# EAGLE design IZU2023_computerboard_ver3 (EAGLE 9.6.2)
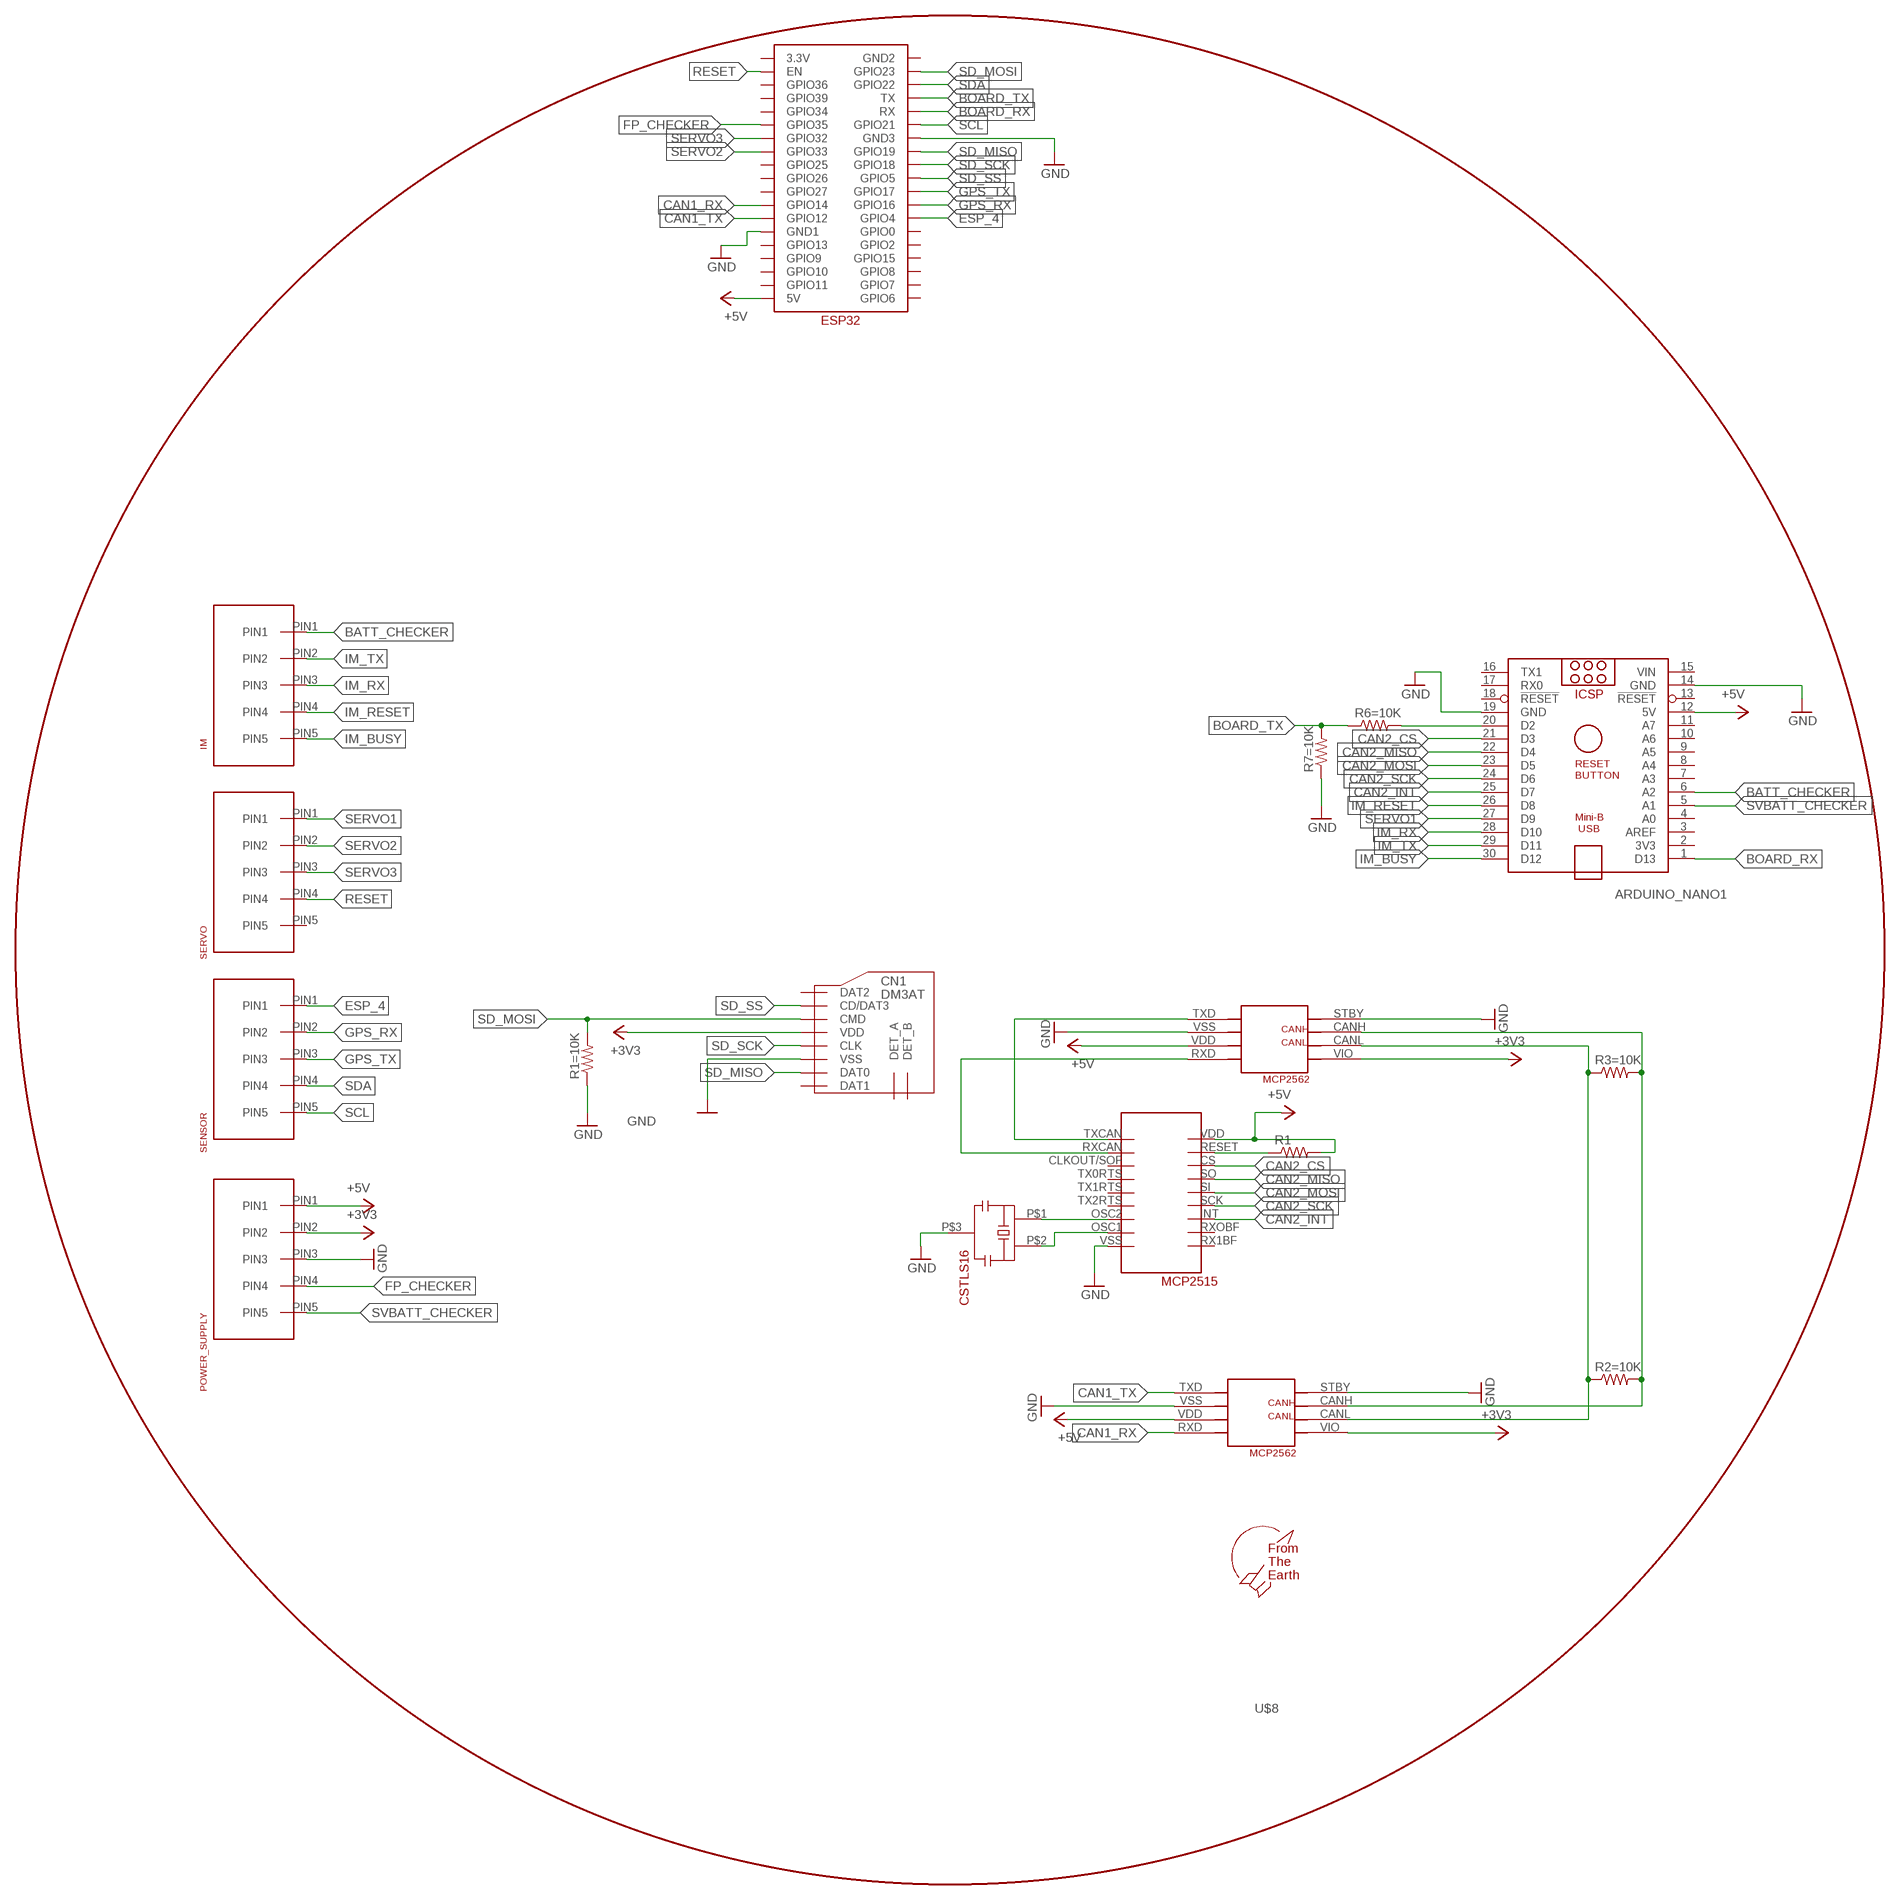
[diagram p0: schematic, sheet 1]

## Parts
ARDUINO_NANO1  ARDUINO_NANO  [ARDUINO_NANO]
CN1  DM3AT  [DM3AT]
IM  5PIN  [5PIN]
POWER_SUPPLY  5PIN  [5PIN]
R1  R-US_0204/7  [0204/7]
R1=10K  R-US_0204/7  [0204/7]
R2=10K  R-US_0204/7  [0204/7]
R3=10K  R-US_0204/7  [0204/7]
R6=10K  R-US_0204/7  [0204/7]
R7=10K  R-US_0204/7  [0204/7]
SENSOR  5PIN  [5PIN]
SERVO  5PIN  [5PIN]
U$2  MCP2515  [MCP2515]
U$3  MCP2562  [MCP2562]
U$4  MCP2562  [MCP2562]
U$5  CSTLS16  [CSTLS16]
U$7  ESP32_ESP32  [ESP32_ESP32]
U$8  F.T.E.LOGO  [LOGO]

## Nets
+3V3 [Power]: CN1.VDD POWER_SUPPLY.PIN2 U$3.VIO U$4.VIO
+5V [Power]: ARDUINO_NANO1.12(5V) POWER_SUPPLY.PIN1 R1.2 U$2.VDD U$3.VDD U$4.VDD U$7.5V
BATT_CHECKER: ARDUINO_NANO1.6(A2) IM.PIN1
BOARD_RX: ARDUINO_NANO1.1(D13) U$7.RX
BOARD_TX: R6=10K.1 R7=10K.2 U$7.TX
CAN1_RX: U$3.RXD U$7.GPIO14
CAN1_TX: U$3.TXD U$7.GPIO12
CAN2_CS: ARDUINO_NANO1.21(D3) U$2.CS
CAN2_INT: ARDUINO_NANO1.25(D7) U$2.INT
CAN2_MISO: ARDUINO_NANO1.22(D4) U$2.SO
CAN2_MOSI: ARDUINO_NANO1.23(D5) U$2.SI
CAN2_SCK: ARDUINO_NANO1.24(D6) U$2.SCK
ESP_4: SENSOR.PIN1 U$7.GPIO4
FP_CHECKER: POWER_SUPPLY.PIN4 U$7.GPIO35
GND: ARDUINO_NANO1.14(GND) ARDUINO_NANO1.19(GND) CN1.VSS POWER_SUPPLY.PIN3 R1=10K.1 R7=10K.1 U$2.VSS U$3.STBY U$3.VSS U$4.STBY U$4.VSS U$5.P$3 U$7.GND1 U$7.GND3
GPS_RX: SENSOR.PIN2 U$7.GPIO16
GPS_TX: SENSOR.PIN3 U$7.GPIO17
IM_BUSY: ARDUINO_NANO1.30(D12) IM.PIN5
IM_RESET: ARDUINO_NANO1.26(D8) IM.PIN4
IM_RX: ARDUINO_NANO1.28(D10) IM.PIN3
IM_TX: ARDUINO_NANO1.29(D11) IM.PIN2
N$1: U$2.TXCAN U$4.TXD
N$2: ARDUINO_NANO1.20(D2) R6=10K.2
N$3: R2=10K.1 R3=10K.1 U$3.CANL U$4.CANL
N$4: R2=10K.2 R3=10K.2 U$3.CANH U$4.CANH
N$5: U$2.RXCAN U$4.RXD
N$6: U$2.OSC2 U$5.P$1
N$7: U$2.OSC1 U$5.P$2
N$8: R1.1 U$2.RESET
RESET: SERVO.PIN4 U$7.EN
SCL: SENSOR.PIN5 U$7.GPIO21
SD_MISO: CN1.DAT0 U$7.GPIO19
SD_MOSI: CN1.CMD R1=10K.2 U$7.GPIO23
SD_SCK: CN1.CLK U$7.GPIO18
SD_SS: CN1.CD/DAT3 U$7.GPIO5
SDA: SENSOR.PIN4 U$7.GPIO22
SERVO1: ARDUINO_NANO1.27(D9) SERVO.PIN1
SERVO2: SERVO.PIN2 U$7.GPIO33
SERVO3: SERVO.PIN3 U$7.GPIO32
SVBATT_CHECKER: ARDUINO_NANO1.5(A1) POWER_SUPPLY.PIN5
Unconnected: ARDUINO_NANO1.2(3V3) ARDUINO_NANO1.3(AREF) ARDUINO_NANO1.4(A0) ARDUINO_NANO1.7(A3) ARDUINO_NANO1.8(A4) ARDUINO_NANO1.9(A5) ARDUINO_NANO1.10(A6) ARDUINO_NANO1.11(A7) ARDUINO_NANO1.13(!RESET) ARDUINO_NANO1.16(TX1) ARDUINO_NANO1.17(RX0) ARDUINO_NANO1.18(!RESET) CN1.DAT1 CN1.DAT2 CN1.DET_A CN1.DET_B SERVO.PIN5 U$2.CLKOUT/SOF U$2.RX1BF U$2.RXOBF(RX0BF) U$2.TX0RTS U$2.TX1RTS U$2.TX2RTS U$7.3.3V U$7.GND2 U$7.GPIO0 U$7.GPIO2 U$7.GPIO6 U$7.GPIO7 U$7.GPIO8 U$7.GPIO9 U$7.GPIO10 U$7.GPIO11 U$7.GPIO13 U$7.GPIO15 U$7.GPIO25 U$7.GPIO26 U$7.GPIO27 U$7.GPIO34 U$7.GPIO36 U$7.GPIO39

## Power pins joined to a net without a drawn wire
VIN: ARDUINO_NANO1.15(VIN)

## Library data of the parts
ARDUINO_NANO1 = ArduinoNanoV30:ARDUINO_NANO: Arduino Nano V3.0 Overview: The Arduino Nano is a small, complete, and breadboard-friendly board based on the ATmega328 (Arduino Nano 3.x) or ATmega168 (Arduino Nano 2.x). It has more or less the same functionality of the Arduino Duemilanove, but in a different package. It lacks only a DC power jack, and works with a Mini-B USB cable instead of a standard one. The Nano was designed and is being produced by Gravitech. Specifications: Microcontroller Atmel ATmega168 or ATmega328 Operating Voltage (logic level) 5 V Input Voltage (recommended) 7-12 V Input Voltage (limits) 6-20 V Digital I/O Pins 14 (of which 6 provide PWM output) Analog Input Pins 8 DC Current per I/O Pin 40 mA Flash Memory 16 KB (ATmega168) or 32 KB (ATmega328) of which 2 KB used by bootloader SRAM 1 KB (ATmega168) or 2 KB (ATmega328) EEPROM 512 bytes (ATmega168) or 1 KB (ATmega328) Clock Speed 16 MHz Dimensions 0.73" x 1.70" Length 45 mm Width 18 mm Weigth 5 g Power: The Arduino Nano can be powered via the Mini-B USB connection, 6-20V unregulated external power supply (pin 30), or 5V regulated external power supply (pin 27). The power source is automatically selected to the highest voltage source. Memory: The ATmega168 has 16 KB of flash memory for storing code (of which 2 KB is used for the bootloader); the ATmega328 has 32 KB, (also with 2 KB used for the bootloader). The ATmega168 has 1 KB of SRAM and 512 bytes of EEPROM (which can be read and written with the EEPROM library); the ATmega328 has 2 KB of SRAM and 1 KB of EEPROM. Input and Output: Each of the 14 digital pins on the Nano can be used as an input or output, using pinMode(), digitalWrite(), and digitalRead() functions. They operate at 5 volts. Each pin can provide or receive a maximum of 40 mA and has an internal pull-up resistor (disconnected by default) of 20-50 kOhms. In addition, some pins have specialized functions. Visit Arduino - ArduinoBoardNano <https://www.arduino.cc/en/Main/ArduinoBoardNano>
CN1 = microSD:DM3AT
IM POWER_SUPPLY SENSOR SERVO = connectors:5PIN
R1 R1=10K R2=10K R3=10K R6=10K R7=10K = rcl:R-US_: RESISTOR, American symbol; SPICEPREFIX: R
U$2 = MCP2515:MCP2515
U$3 U$4 = MCP2562:MCP2562
U$5 = CSTLS16:CSTLS16
U$7 = ESPdev:ESP32_ESP32
U$8 = logo:F.T.E.LOGO

## Net classes
1 Power: width 1.016 mm

## Board
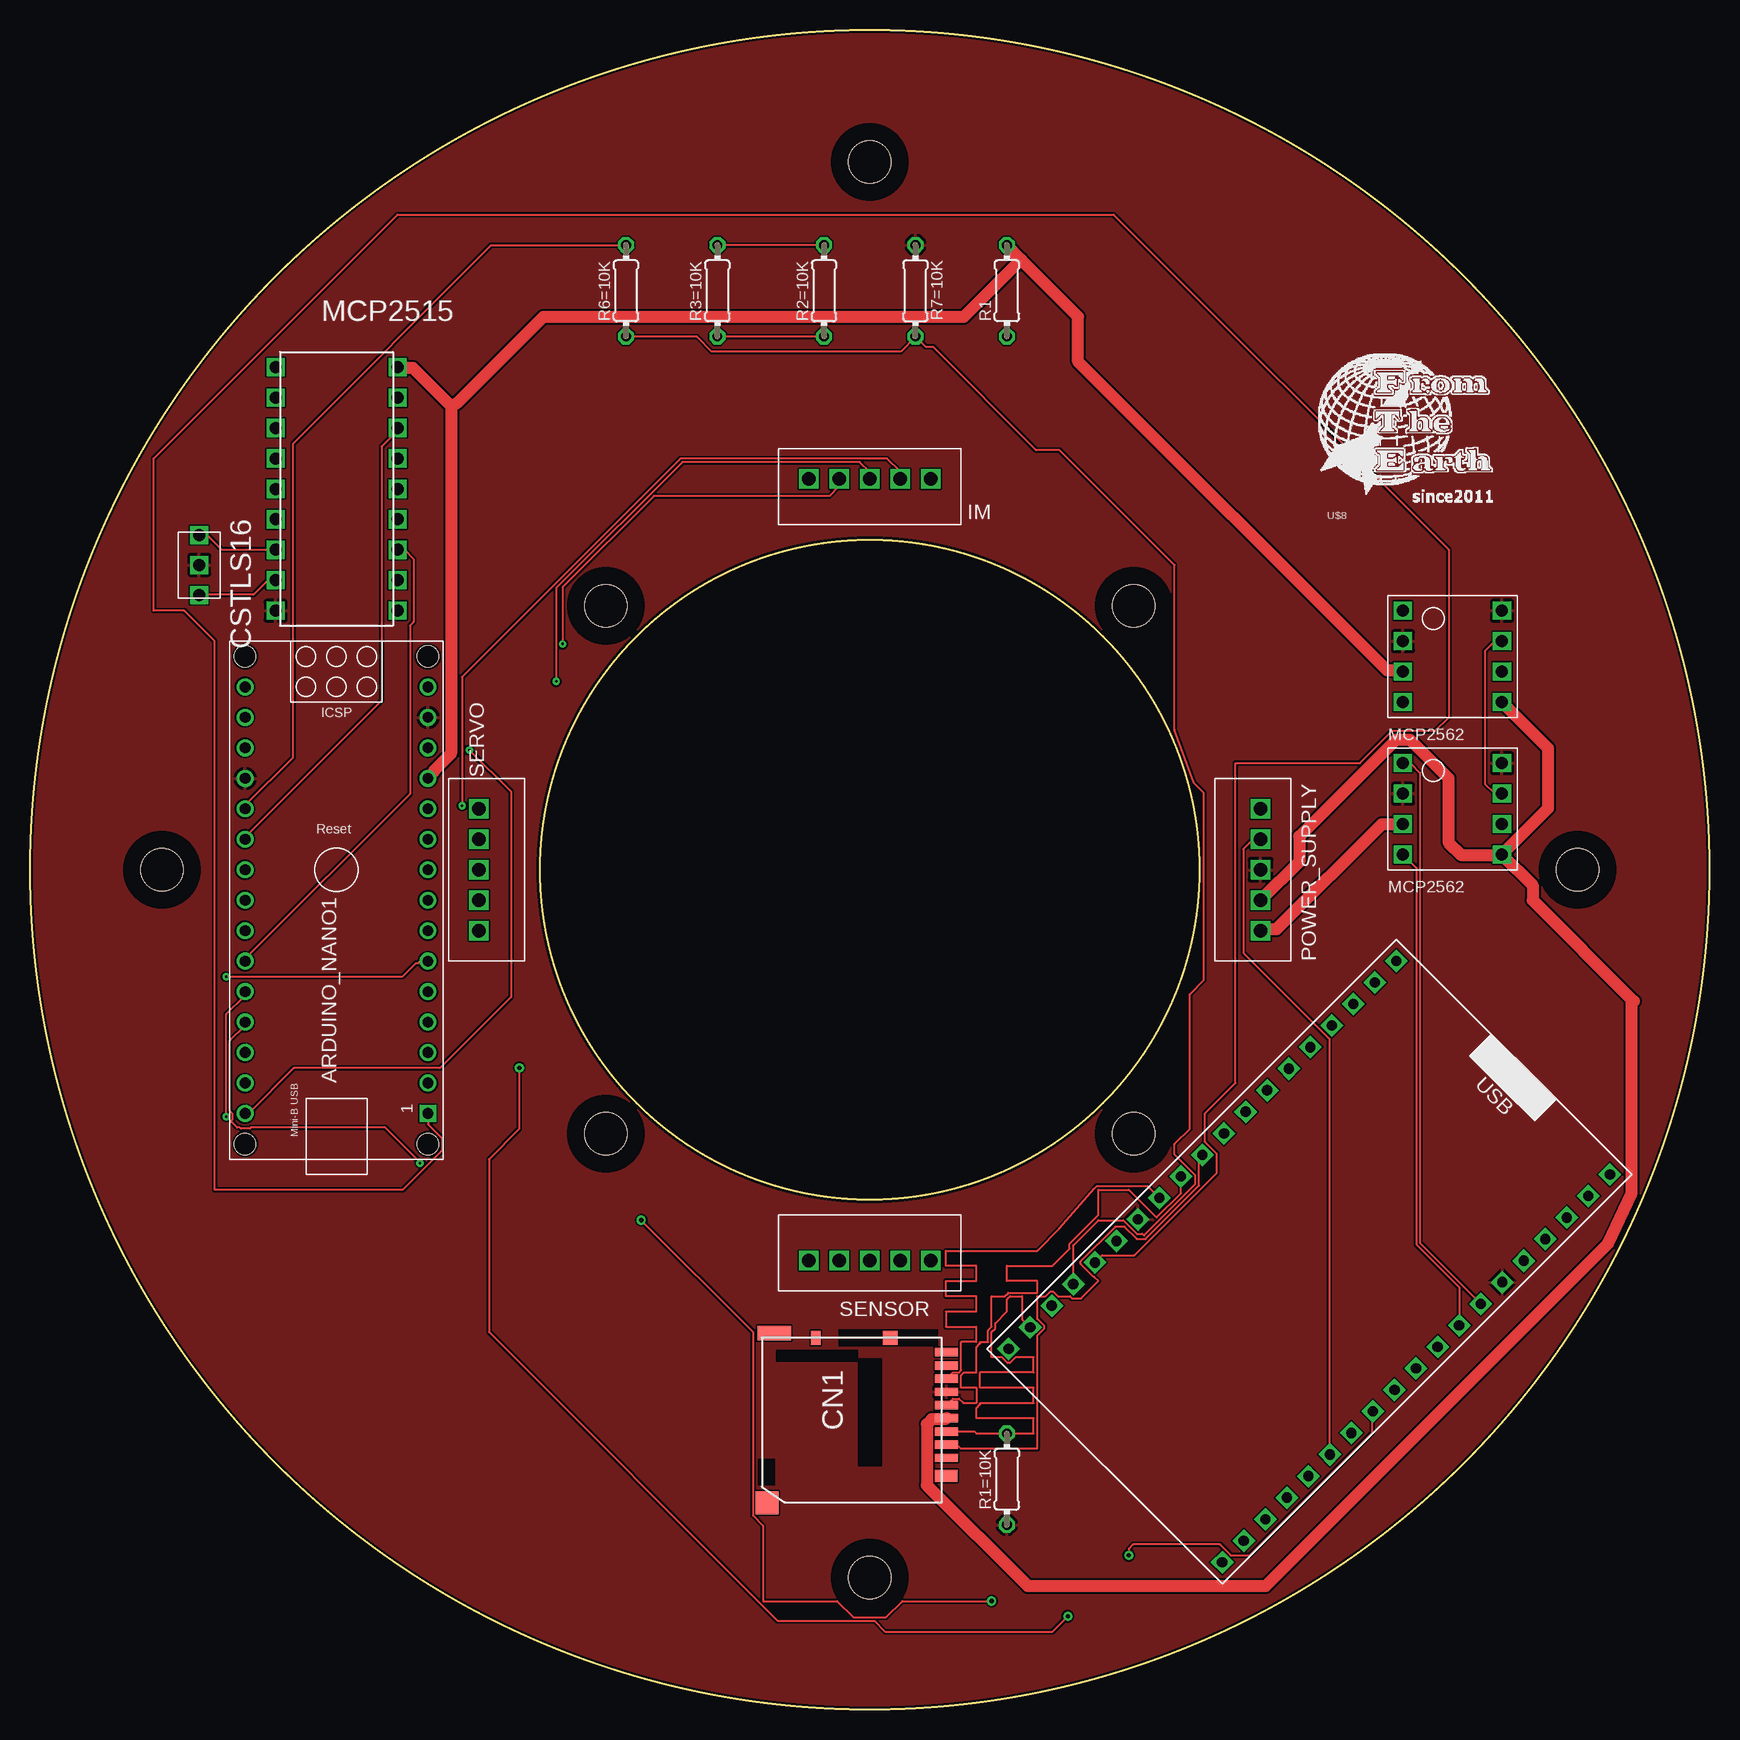
[diagram p1: board, top side]
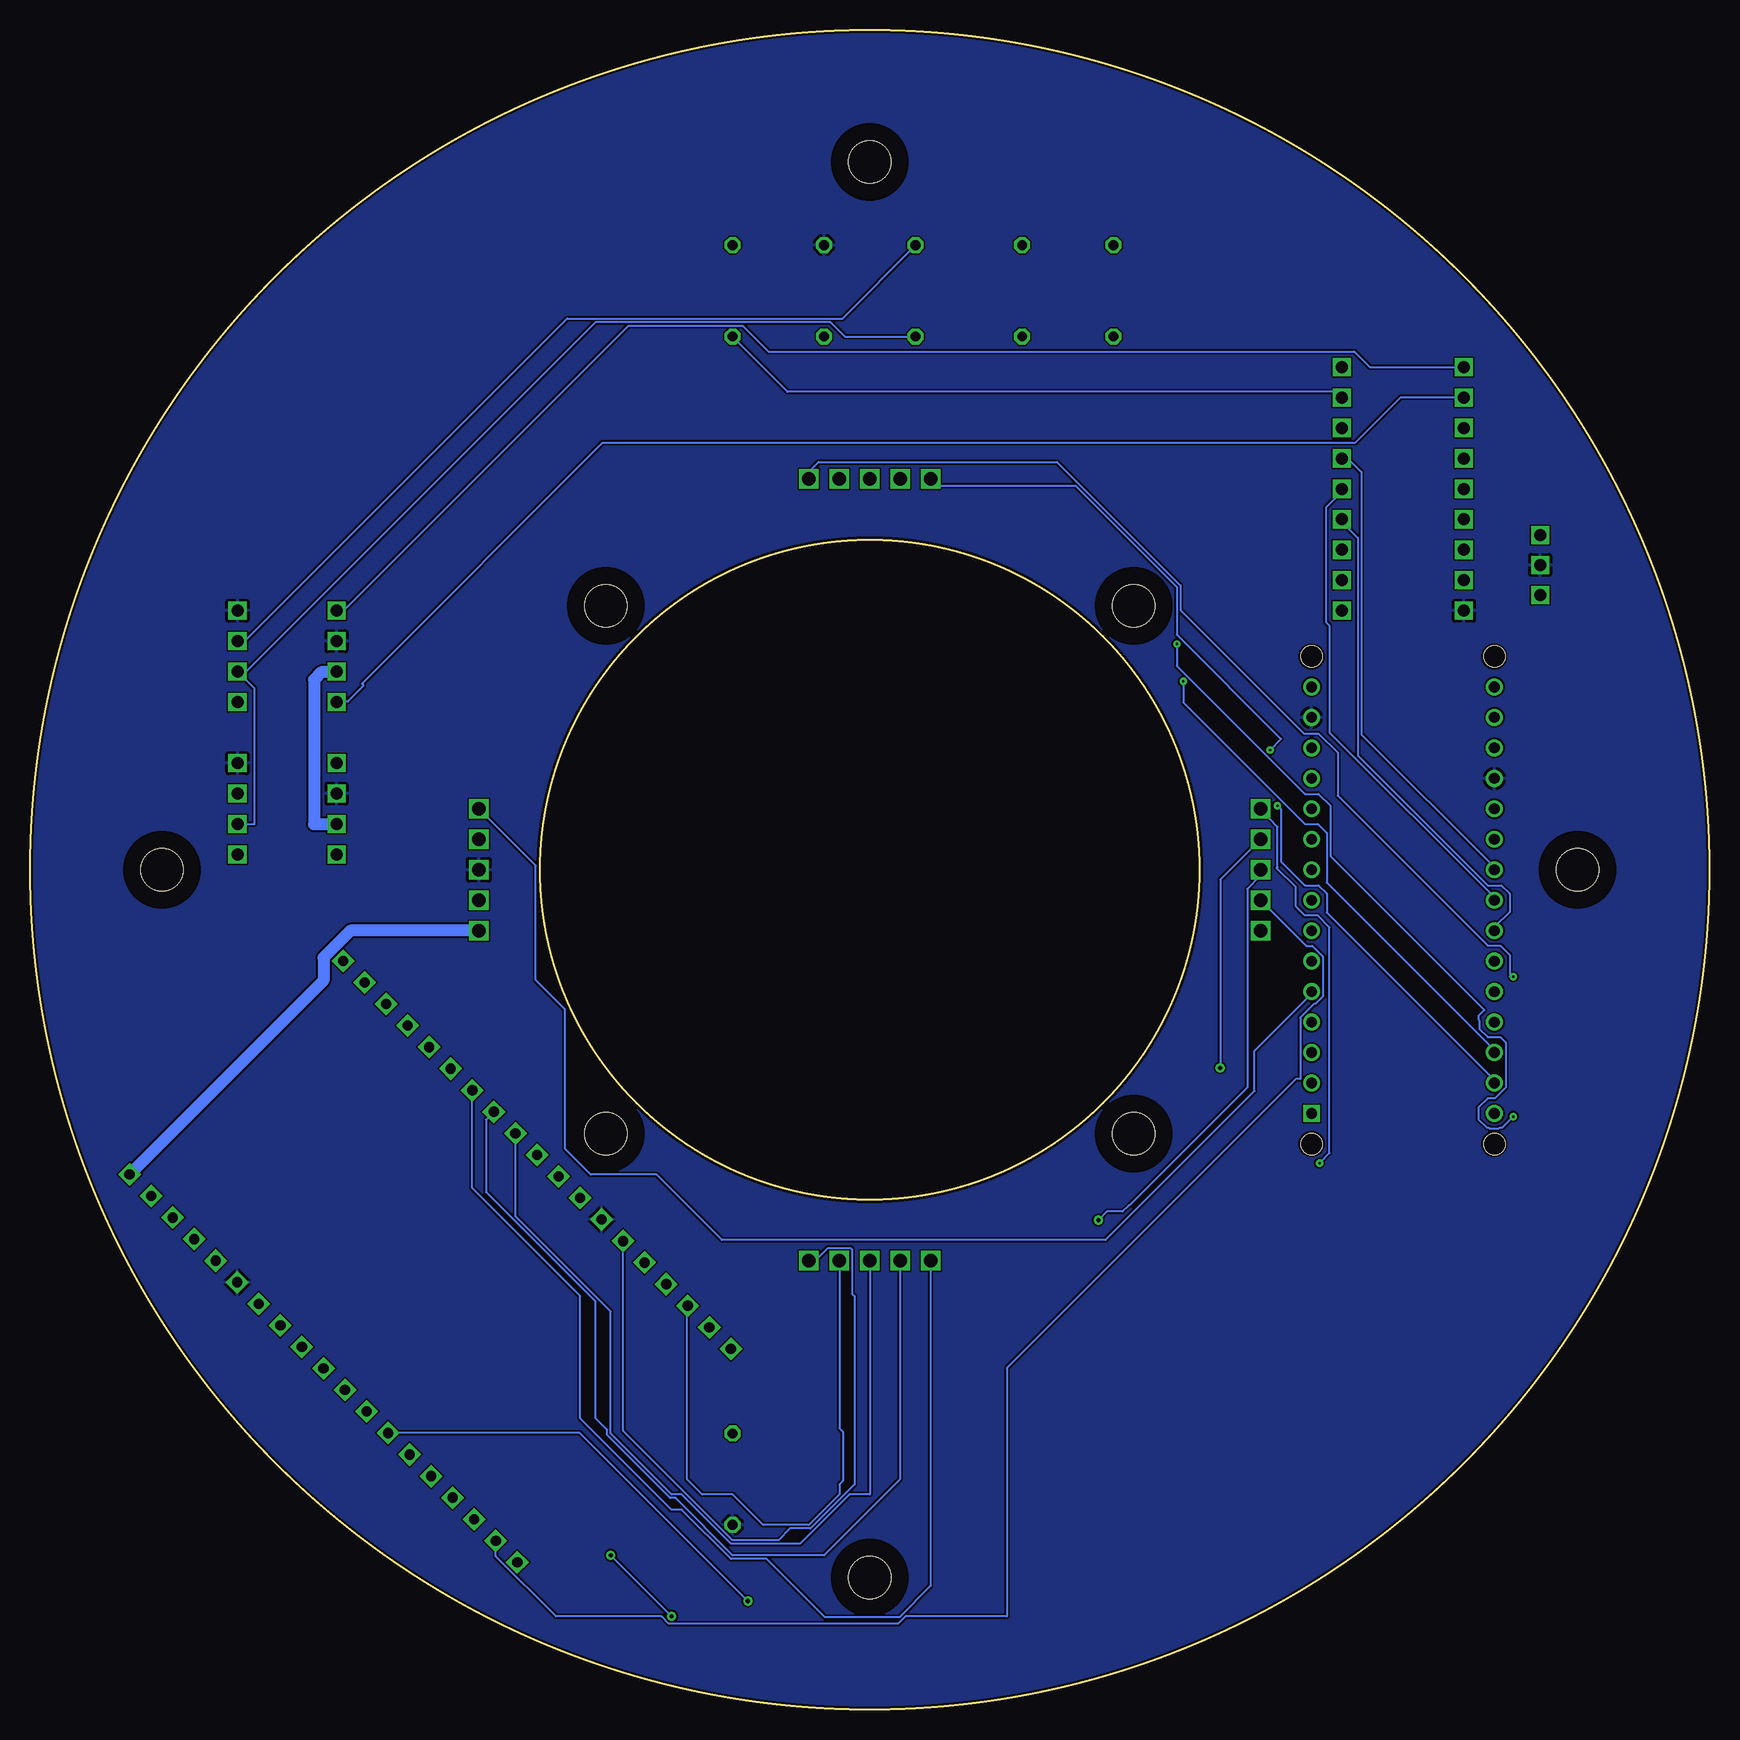
[diagram p2: board, bottom side, seen from below]

Size 140 x 140 mm. Coordinates in mm from the lower left corner, seen from the top.
Outline: circle at 70,70 radius 70
Outline: circle at 70,70 radius 27.5
Copper layers (1*16): Top 0.035mm / dielectric 1.5mm / Bottom 0.035mm
Design rules "PCBGoGo": minimum track width 6mil, minimum drill 0.2mm, track to track 6mil, track to pad 6mil, pad to pad 6mil, via to via 6mil, smd to smd 6mil, copper to edge 0.2mm, drill to drill 6mil, minimum pad ring 10mil, minimum via ring 8mil, stop-mask expansion 4mil, vias tented up to drill 0mil, thermal gap 10mil
Holes 3.5 mm at 70,129 129,70 11,70 92,92 48,48 48,92 92,48 70,11
tRestrict: area 44.9,88.8 to 51.1,95.2; area 44.9,44.9 to 51.1,51.1; area 88.8,44.9 to 95.2,51.1; area 88.8,88.8 to 95.2,95.2; area 125.8,66.8 to 132.2,73.2; area 66.8,125.8 to 73.2,132.2; area 7.9,66.8 to 14.1,73.2; area 66.8,7.9 to 73.2,14.1
bRestrict: area 7.9,66.8 to 14.1,73.2; area 88.8,44.9 to 95.2,51.1; area 125.8,66.8 to 132.2,73.2; area 88.8,88.8 to 95.2,95.2; area 44.9,44.9 to 51.1,51.1; area 44.9,88.8 to 51.1,95.2; area 66.8,125.8 to 73.2,132.2; area 66.8,7.9 to 73.2,14.1
vRestrict: area 61.1,16.7 to 76.3,30.6; area 79.5,10.3 to 133.3,64.2; area 16.7,45.9 to 34.4,89; area 11.6,91.6 to 16.7,99.2; area 20.5,90.3 to 30.6,113.2; area 113.2,82.7 to 123.3,92.9; area 113.2,70 to 124.6,80.2; area 123.3,82.7 to 124.6,92.9

### Footprints (pad centres in the part's own frame; a part is rotated, then mirrored left to right if it is on the bottom)
ARDUINO_NANO = drill 0.9 square: 1 -20.32,-7.62 | drill 0.9: 2 -17.78,-7.62; 3 -15.24,-7.62; 4 -12.7,-7.62; 5 -10.16,-7.62; 6 -7.62,-7.62; 7 -5.08,-7.62; 8 -2.54,-7.62; 9 0,-7.62; 10 2.54,-7.62; 11 5.08,-7.62; 12 7.62,-7.62; 13 10.16,-7.62; 14 12.7,-7.62; 15 15.24,-7.62; 16 15.24,7.62; 17 12.7,7.62; 18 10.16,7.62; 19 7.62,7.62; 20 5.08,7.62; 21 2.54,7.62; 22 0,7.62; 23 -2.54,7.62; 24 -5.08,7.62; 25 -7.62,7.62; 26 -10.16,7.62; 27 -12.7,7.62; 28 -15.24,7.62; 29 -17.78,7.62; 30 -20.32,7.62 | hole 1.778: -22.86,-7.62; -22.86,7.62; 17.78,7.62; 17.78,-7.62
DM3AT = smd 0.7 x 1.9: CD/DAT3 2.2,6.4; CLK -1.1,6.4; CMD 1.1,6.4; DAT0 -3.3,6.4; DAT1 -4.4,6.4; DAT2 3.3,6.4; DET_B -5.5,6.4; VDD 0,6.4; VSS -2.2,6.4 | smd 1.2 x 0.8: DET_A -6.7,-4.5 | smd 1 x 1.9: P$9 4.8,6.381 | smd 1.2 x 1.2: P$11 -6.7,1.7 | smd 1.2 x 2.8: P$13 -7.081,-7.973 | smd 1.9 x 1.9: P$14 7.054,-8.562
5PIN = drill 1.1 square: PIN1 -5.08,-5.08; PIN2 -2.54,-5.08; PIN3 0,-5.08; PIN4 2.54,-5.08; PIN5 5.08,-5.08
0204/7 = drill 0.813 octagon: 1 -3.81,0; 2 3.81,0
MCP2515 = drill 1 square: CLKOUT/SOF -5.08,5.08; CS 5.08,5.08; INT 5.08,-5.08; OSC1 -5.08,-7.62; OSC2 -5.08,-5.08; RESET 5.08,7.62; RX1BF 5.08,-10.16; RXCAN -5.08,7.62; RXOBF 5.08,-7.62; SCK 5.08,-2.54; SI 5.08,0; SO 5.08,2.54; TX0RTS -5.08,2.54; TX1RTS -5.08,0; TX2RTS -5.08,-2.54; TXCAN -5.08,10.16; VDD 5.08,10.16; VSS -5.08,-10.16
MCP2562 = drill 1 square: CANH 8.255,6.35; CANL 8.255,3.81; RXD 0,1.27; STBY 8.255,8.89; TXD 0,8.89; VDD 0,3.81; VIO 8.255,1.27; VSS 0,6.35
CSTLS16 = drill 1 square: P$1 -2.5,0; P$2 2.5,0; P$3 0,0
ESP32_ESP32 = drill 0.85 square: 3.3V 1.27,46.99; 5V 1.27,1.27; EN 1.27,44.45; GND1 1.27,13.97; GND2 26.44,46.99; GND3 26.44,31.75; GPIO0 26.44,13.97; GPIO2 26.44,11.43; GPIO4 26.44,16.51; GPIO5 26.44,24.13; GPIO6 26.44,1.27; GPIO7 26.44,3.81; GPIO8 26.44,6.35; GPIO9 1.27,8.89; GPIO10 1.27,6.35; GPIO11 1.27,3.81; GPIO12 1.27,16.51; GPIO13 1.27,11.43; GPIO14 1.27,19.05; GPIO15 26.44,8.89; GPIO16 26.44,19.05; GPIO17 26.44,21.59; GPIO18 26.44,26.67; GPIO19 26.44,29.21; GPIO21 26.44,34.29; GPIO22 26.44,41.91; GPIO23 26.44,44.45; GPIO25 1.27,26.67; GPIO26 1.27,24.13; GPIO27 1.27,21.59; GPIO32 1.27,31.75; GPIO33 1.27,29.21; GPIO34 1.27,36.83; GPIO35 1.27,34.29; GPIO36 1.27,41.91; GPIO39 1.27,39.37; RX 26.44,36.83; TX 26.44,39.37

### Placement (x,y rotation side)
ARDUINO_NANO1  25.55,70 90 top
CN1  70,24.28 270 top
IM  70,97.5 180 top
POWER_SUPPLY  97.5,70 90 top
R1  81.43,118.26 90 top
R1=10K  81.43,19.2 90 top
R2=10K  66.19,118.26 90 top
R3=10K  57.3,118.26 90 top
R6=10K  49.68,118.26 90 top
R7=10K  73.81,118.26 270 top
SENSOR  70,42.5 0 top
SERVO  42.5,70 270 top
U$2  25.55,101.75 0 top
U$3  114.45,70 0 top
U$4  114.45,82.7 0 top
U$5  14.12,95.4 270 top
U$7  133.5,44.6 135 top
U$8  106.83,99.21 0 top

### Tracks (layer width: path | path; a pad name or v marks a point on that pad's centre or on a via)
+3V3
  Top 1.016: U$3.VIO 122.65,71.22 119.32,71.22 118.24,72.29 118.24,77.64 115.06,80.82 113.84,80.82 105.79,72.77 105.79,70.63 102.62,67.46 POWER_SUPPLY.PIN2 | U$4.VIO 126.54,80.14 126.54,75.11 U$3.VIO | U$3.VIO 125.27,68.71 125.27,67.48 133.7,59.04 133.5,58.84 133.5,43.02 131.55,38.84 103.02,10.31 83.17,10.31 74.77,18.71 74.77,23.78 75.18,24.19 76.31,24.19 CN1.VDD
+5V
  Top 1.016: U$3.VDD 112.67,73.81 103.91,65.05 102.69,65.05 102.61,64.97 POWER_SUPPLY.PIN1 | 82.61,120.86 87.37,116.1 87.37,112.37 113.13,86.61 114.35,86.61 U$4.VDD | 82.61,120.86 81.43,122.05 R1.2 | 35.1,108.63 35.1,79.68 33.73,78.31 33.73,78.23 33.2,77.7 33.2,77.62 ARDUINO_NANO1.12 | 35.1,108.63 31.9,111.83 30.76,111.83 30.68,111.91 U$2.VDD | 82.61,120.86 77.85,116.1 42.8,116.1 35.56,108.86 35.1,108.63
  Bottom 1.016: U$3.VDD 116.33,73.81 116.33,85.85 115.72,86.46 114.5,86.46 U$4.VDD | U$7.5V 115.53,60.78 115.53,62.67 113.28,64.92 POWER_SUPPLY.PIN1
BATT_CHECKER  (via drill 0.2)
  Top 0.152: ARDUINO_NANO1.6 32.51,62.38 32.36,62.23 32.2,62.23 31.06,61.09 v16.35,61.09
  Bottom 0.152: IM.PIN1 75.03,102.61 75.03,103.22 74.27,103.98 54.38,103.98 44.09,93.7 44.09,91.64 33.8,81.35 32.59,81.35 30.99,79.75 30.99,76.17 18.49,63.67 17.42,63.67 16.66,62.91 16.66,61.09 v16.35,61.09
BOARD_RX
  Top 0.152: ARDUINO_NANO1.1 33.17,48.79 34.34,47.62 34.34,46.61 31.05,43.33 15.39,43.33 15.39,89.05 12.85,91.59 10.31,91.59 10.31,104.29 30.63,124.61 90.32,124.61 118.26,96.67 118.26,82.7 117.12,81.56 113.53,81.56 110.87,78.89 100.48,78.89 100.48,52.22 97.94,49.68 97.94,47.32 98.93,46.33 98.93,44.73 92.06,37.86 89.37,37.86 U$7.RX
BOARD_TX
  Top 0.152: 73.81,114.42 72.59,113.2 56.82,113.2 55.6,114.42 49.73,114.42 R6=10K.1 | 73.81,114.42 74.65,113.59 75.26,113.59 83.87,104.98 85.82,104.98 95.4,95.4 95.4,81.65 97.01,77.24 97.85,76.39 97.85,60.8 96.67,59.62 96.67,48.41 95.4,47.14 95.4,46.27 97.13,44.53 97.13,43.79 92.86,39.52 92.72,39.66 92.26,39.66 91.12,40.79 89.05,40.79 86.97,38.7 U$7.TX | 73.81,114.42 R7=10K.2
CAN1_RX
  Top 0.152: U$3.RXD 115.57,70.15 115.57,38.75 119.13,35.19 U$7.GPIO14
CAN1_TX
  Top 0.152: U$3.TXD 114.5,78.84 115.11,78.84 115.87,78.08 115.87,38.88 U$7.GPIO12
CAN2_CS
  Top 0.152: ARDUINO_NANO1.21 17.95,72.59 17.95,72.74 29.31,84.1 29.31,105.28 30.6,106.58 30.6,106.81 U$2.CS
CAN2_INT
  Top 0.152: U$2.INT 31.21,96.67 31.98,95.91 31.98,90.65 31.67,90.34 31.67,76.33 17.95,62.61 17.95,62.38 ARDUINO_NANO1.25
CAN2_MISO
  Bottom 0.152: U$2.SO 30.15,104.29 29,103.15 29,81.28 17.95,70.23 17.95,70 ARDUINO_NANO1.22
CAN2_MOSI
  Bottom 0.152: ARDUINO_NANO1.23 17.95,67.48 17.95,67.71 31.67,81.43 31.67,90.34 31.98,90.65 31.98,100.17 30.68,101.47 30.68,101.7 U$2.SI
CAN2_SCK
  Bottom 0.152: ARDUINO_NANO1.24 17.88,64.97 17.88,65.28 16.66,66.5 16.66,68.02 17.35,68.7 18.49,68.7 29.31,79.53 29.31,97.66 30.6,98.96 30.6,99.19 U$2.SCK
ESP_4
  Bottom 0.152: U$7.GPIO4 103.13,43.46 94.13,34.46 94.13,24.28 86.51,16.66 85.67,16.66 81.56,12.55 78.59,12.55 73.74,7.7 67.53,7.7 64.92,10.31 SENSOR.PIN1
FP_CHECKER
  Top 0.152: POWER_SUPPLY.PIN4 102.54,72.52 101.93,72.52 101.13,71.71 101.17,71.68 101.17,63.07 108.33,55.9 108.33,21.31 U$7.GPIO35
GND
  pour Bottom: 30.63,141.12 103.02,141.12 106.83,137.31 142.39,101.75 142.39,35.71 105.56,-1.12 33.17,-1.12 -4.93,36.98 -4.93,115.72 20.47,141.12
  pour Top: 19.2,144.93 104.29,144.93 147.47,101.75 147.47,31.9 146.2,30.63 110.64,-4.93 109.37,-4.93 26.82,-4.93 -15.09,36.98 -15.09,119.53 -11.28,123.34 10.31,144.93
GPS_RX
  Bottom 0.152: SENSOR.PIN2 67.46,19.2 73.81,12.85 81.43,12.85 86.2,17.62 86.64,17.62 91.89,22.88 91.89,23.31 92.86,24.28 92.86,34.01 102,43.14 102,49.16 U$7.GPIO16
GPS_TX
  Bottom 0.152: SENSOR.PIN3 70,17.93 71.68,17.93 75.79,13.81 81.56,13.81 85.67,17.93 86.51,17.93 91.59,23.01 91.59,33.17 99.54,41.12 U$7.GPIO17
IM_BUSY  (via drill 0.2)
  Top 0.152: v36.62,79.98 40.1,76.5 40.1,59.38 34.19,53.47 21.99,53.47 18.26,49.73 17.95,49.73 ARDUINO_NANO1.30
  Bottom 0.152: IM.PIN5 64.89,102.54 64.36,102 52.86,102 44.4,93.55 44.4,89.58 35.71,80.9 v36.62,79.98
IM_RESET  (via drill 0.2)
  Top 0.152: v44.4,88.82 44.4,93.55 52.02,101.17 66.65,101.17 67.41,101.93 67.41,102.54 IM.PIN4 | v16.35,49.43 16.35,57.96 17.88,59.48 17.88,59.79 ARDUINO_NANO1.26
  Bottom 0.152: v44.4,88.82 44.4,86.99 33.73,76.33 32.59,76.33 31.59,75.33 31.59,71.14 18.76,58.3 19.25,57.81 19.25,57.5 19.17,57.43 19.17,56.74 18.49,56.05 17.42,56.05 16.97,55.6 16.97,51.86 17.88,50.95 18.49,50.95 19.25,50.19 19.25,49.2 18.56,48.51 18.41,48.51 18.34,48.44 17.57,48.44 17.5,48.51 17.27,48.51 v16.35,49.43
IM_RX  (via drill 0.2)
  Top 0.152: v43.86,85.7 43.86,93.47 54.38,103.98 69.16,103.98 70,103.15 IM.PIN3
  Bottom 0.152: v43.86,85.7 43.86,83.94 33.73,73.81 32.66,73.81 31.9,73.05 31.9,68.93 17.95,54.99 17.95,54.76 ARDUINO_NANO1.28
IM_TX  (via drill 0.2)
  Top 0.152: v36.02,75.33 36.02,86.08 54.23,104.29 71.45,104.29 72.52,103.22 72.52,102.61 IM.PIN2
  Bottom 0.152: v36.02,75.33 35.71,75.03 35.71,70.69 33.73,68.7 32.59,68.7 31.9,68.02 31.9,66.42 17.95,52.47 17.95,52.25 ARDUINO_NANO1.29
N$1
  Bottom 0.152: U$2.TXCAN 28.32,111.91 29.61,113.2 78.46,113.2 80.59,115.34 90.12,115.34 113.81,91.64 114.42,91.64 U$4.TXD
N$2
  Top 0.152: R6=10K.2 49.66,122.05 38.45,122.05 21.92,105.51 21.92,79.37 17.95,75.41 17.95,75.11 ARDUINO_NANO1.20
N$3
  Top 0.152: R3=10K.1 57.35,114.42 66.19,114.42 R2=10K.1
  Bottom 0.152: U$3.CANL 121.28,73.81 121.28,85.09 U$4.CANL 121.99,86.51 92.86,115.64 73.28,115.64 72.06,114.42 66.19,114.42 R2=10K.1
N$4
  Top 0.152: R3=10K.2 57.35,122.05 66.19,122.05 R2=10K.2 | U$4.CANH 122.12,89.05 121.28,88.21 121.28,77.16 122.05,76.4 122.65,76.4 U$3.CANH
  Bottom 0.152: U$4.CANH 122.12,89.05 95.22,115.95 72.29,115.95 66.19,122.05 R2=10K.2
N$5
  Bottom 0.152: U$2.RXCAN 20.47,109.4 25.73,109.4 29.54,105.59 92.25,105.59 112.33,85.51 112.22,85.39 112.22,85.32 113.51,84.02 114.42,84.02 U$4.RXD
N$6
  Top 0.152: U$2.OSC2 15.97,96.67 14.76,97.89 14.15,97.89 U$5.P$1
N$7
  Top 0.152: U$5.P$2 14.15,92.94 18.64,92.94 19.78,94.08 20.47,94.08 U$2.OSC1
N$8
  Bottom 0.152: R1.1 81.43,114.42 76.86,109.85 31.14,109.85 30.68,109.4 U$2.RESET
RESET
  Bottom 0.152: SERVO.PIN4 33.61,63.65 33.12,63.65 32.24,62.77 32.24,59.45 32.87,58.82 32.97,58.82 34.12,57.67 34.12,52.55 34.49,52.55 58.57,28.47 58.57,7.77 67.03,7.77 67.64,7.16 86.76,7.16 87.37,7.77 96.16,7.77 101.17,12.78 U$7.EN
SCL
  Bottom 0.152: SENSOR.PIN5 74.51,37.42 73.46,38.47 71.62,38.47 71.49,38.34 71.49,34.66 71.27,34.44 71.27,18.77 74.95,15.09 76.66,15.09 77.62,14.12 81.43,14.12 90.56,23.25 U$7.GPIO21
SD_MISO
  Top 0.152: CN1.DAT0 76.92,28.1 77.44,28.1 77.62,28.28 77.62,30.63 78.89,30.63 78.89,31.9 76.35,31.9 76.35,33.17 78.89,33.17 78.89,34.44 76.35,34.44 76.35,35.71 78.89,35.71 78.89,36.98 76.35,36.98 76.35,38.25 83.97,38.25 85.81,40.09 88.75,43.45 88.75,43.46 88.92,43.64 91.72,43.64 91.72,43.63 93.16,43.63 U$7.GPIO19
SD_MOSI
  Top 0.152: U$7.GPIO23 82.7,32.54 82.7,34.44 81.69,34.44 81.57,34.32 81.43,34.16 81.43,33.17 80.47,32.2 80.47,31.77 80.16,31.47 80.16,29.36 81,29.36 81.48,28.88 81.67,28.88 82.15,29.36 83.66,29.36 83.66,28.09 79.19,28.09 79.19,26.82 83.66,26.82 83.66,25.55 79.19,25.55 79.19,25.42 78.89,25.12 78.89,24.28 83.66,24.28 83.66,23.01 R1=10K.2 78.89,23.01 78.72,23.18 CN1.CMD
SD_SCK
  Top 0.152: CN1.CLK 76.92,25.9 77.44,25.9 77.8,25.55 78.89,25.55 78.89,26.82 77.62,26.82 77.62,27.85 77.86,28.09 78.89,28.09 78.89,30.2 79.19,30.5 79.19,30.63 79.86,30.63 79.86,31.59 80.16,31.9 80.16,34.44 81.25,34.44 81.55,34.74 83.97,34.74 83.97,35.71 81.43,35.71 81.43,36.98 85.24,36.98 86.66,38.4 86.66,38.83 89.05,41.22 89.05,43.33 91.59,43.33 93.91,41.01 95.95,43.04 U$7.GPIO18
SD_SS
  Top 0.152: CN1.CD/DAT3 77.28,22.08 77.62,21.74 83.97,21.74 83.97,31.18 84.56,31.77 84.56,31.96 83.97,32.55 83.97,34.44 84.66,34.44 85.08,34.85 85.26,34.85 85.67,34.44 86.7,34.44 86.87,34.27 87.61,34.27 89.05,35.71 88.7,36.06 88.67,36.06 87.57,37.16 87.57,37.35 90.46,40.24 91.25,40.24 92.27,39.22 92.99,39.22 97.44,43.67 97.44,45.93 U$7.GPIO5
SDA
  Bottom 0.152: SENSOR.PIN4 72.54,23.44 72.23,23.14 72.23,19.07 72.54,18.77 72.54,17.93 75.08,15.39 78.89,15.39 81.43,17.93 83.97,17.93 85.24,19.2 85.24,33.59 U$7.GPIO22
SERVO1  (via drill 0.2)
  Top 0.152: ARDUINO_NANO1.27 17.88,57.27 17.88,56.97 16.66,55.75 16.66,49.88 16.89,49.66 16.89,49.2 16.81,49.12 16.81,48.97 17.27,48.51 17.5,48.51 17.57,48.44 18.34,48.44 18.41,48.51 29.61,48.51 32.55,45.58 v32.51,45.54
  Bottom 0.152: v32.51,45.54 31.67,46.38 31.67,65.2 32.66,66.19 33.73,66.19 34.49,66.95 34.49,68.55 36.09,70.15 36.02,70.23 36.02,73.58 36.7,74.27 36.7,74.34 37.39,75.03 SERVO.PIN1
SERVO2  (via drill 0.35)
  Top 0.152: U$7.GPIO33 111.91,24.81 111.91,23.06 101.7,12.85 100.1,12.85 99.19,13.76 91.95,13.76 91.59,13.41 v91.59,12.85 | v40.79,53.49 40.79,48.41 38.25,45.87 38.25,31.47 62.33,7.39 70.38,7.39 71.27,6.5 85.24,6.5 v86.51,7.77
  Bottom 0.152: SERVO.PIN2 40.79,69.17 v40.79,53.49 | v91.59,12.85 v86.51,7.77
SERVO3  (via drill 0.35)
  Top 0.152: v50.95,40.79 60.26,31.48 60.26,16.18 61.11,15.33 61.11,9.04 67.29,9.04 68.63,7.7 71.37,7.7 72.71,9.04 v80.16,9.04
  Bottom 0.152: SERVO.PIN3 37.46,70 37.46,69.47 38.53,68.4 38.53,51.86 48.37,42.02 48.4,42.02 48.92,41.5 50.24,41.5 v50.95,40.79 | v80.16,9.04 94.17,23.05 U$7.GPIO32
SVBATT_CHECKER
  Bottom 0.152: 33.2,59.64 33.2,59.79 ARDUINO_NANO1.5 33.2,59.64 | 33.2,59.64 37.92,54.91 37.92,51.56 50.34,39.14 82.32,39.14 87.78,44.6 93.27,44.6 95.4,46.73 95.4,58.35 97.85,60.8 97.85,70.35 POWER_SUPPLY.PIN5